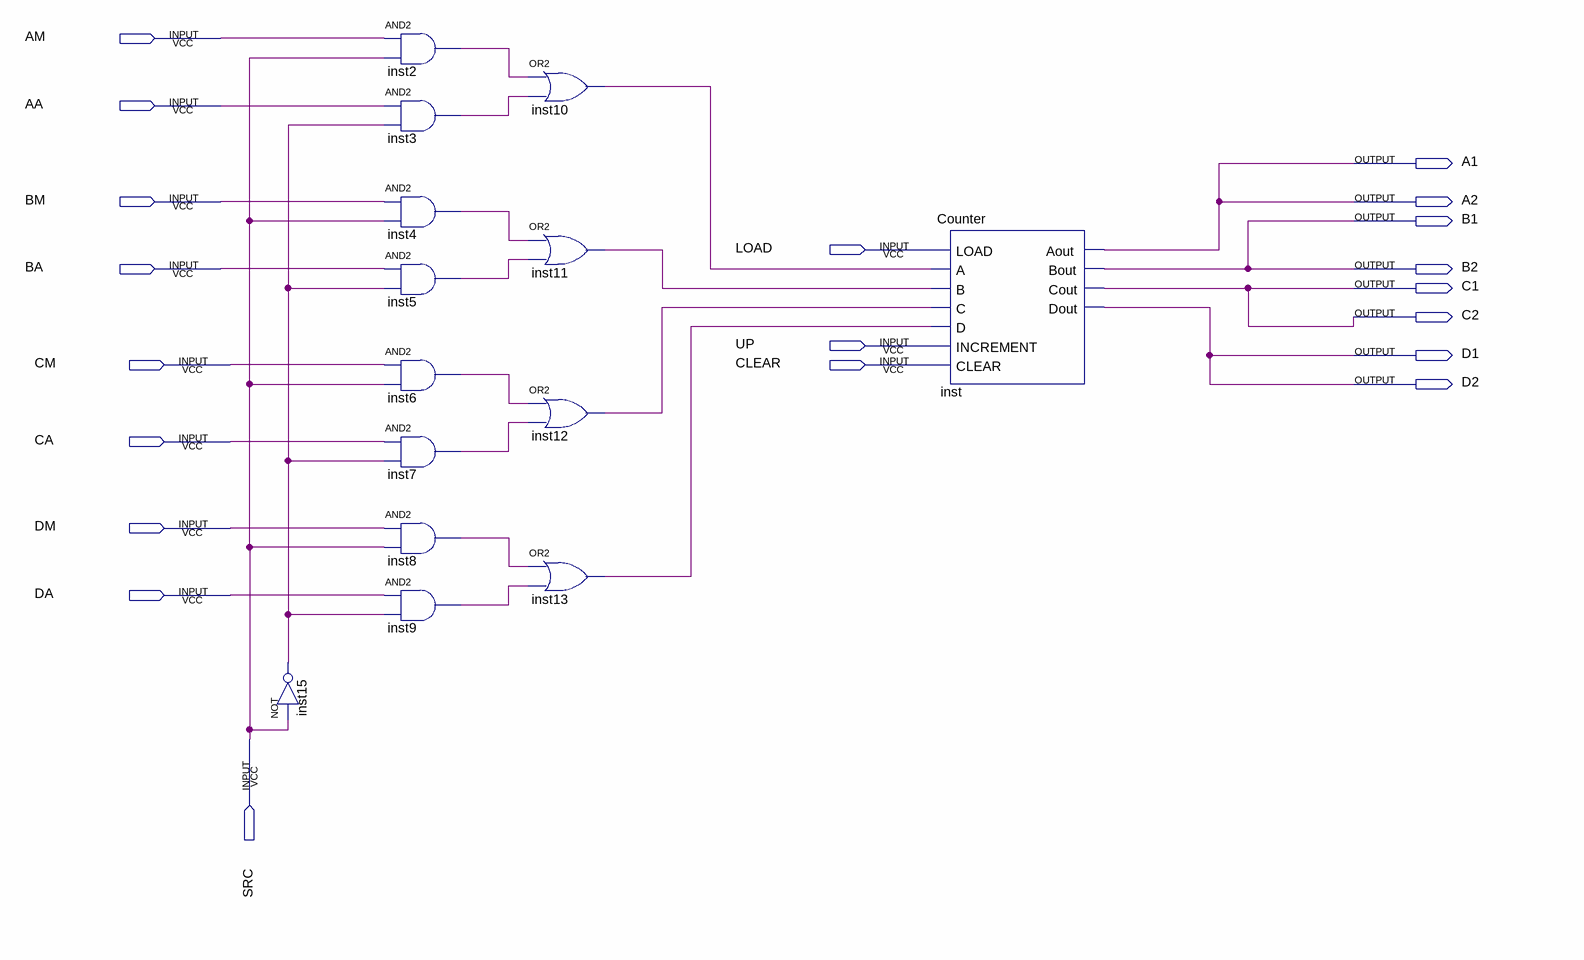
[diagram p0: schematic sheet]
// Quartus schematic Accumulator.bdf as structural Verilog: 14 symbols, 20 pins
module Accumulator (
  input  AM,
  input  AA,
  input  BM,
  input  LOAD,
  input  BA,
  input  UP,
  input  CM,
  input  CLEAR,
  input  CA,
  input  DM,
  input  DA,
  input  SRC,
  output A1,
  output A2,
  output B1,
  output B2,
  output C1,
  output C2,
  output D1,
  output D2
);

  wire inst2_out, inst3_out, inst4_out, inst5_out, inst6_out, inst7_out, inst8_out, inst9_out, inst10_out,
       inst11_out, inst12_out, inst13_out, inst15_out;

  not inst15 (inst15_out, SRC);
  and inst2 (inst2_out, AM, SRC);
  and inst3 (inst3_out, AA, inst15_out);
  and inst4 (inst4_out, BM, SRC);
  and inst5 (inst5_out, BA, inst15_out);
  and inst6 (inst6_out, CM, SRC);
  and inst7 (inst7_out, CA, inst15_out);
  and inst8 (inst8_out, DM, SRC);
  and inst9 (inst9_out, DA, inst15_out);
  or inst10 (inst10_out, inst2_out, inst3_out);
  or inst11 (inst11_out, inst4_out, inst5_out);
  or inst12 (inst12_out, inst6_out, inst7_out);
  or inst13 (inst13_out, inst8_out, inst9_out);
  Counter inst (
    .LOAD(LOAD), .A(inst10_out), .B(inst11_out), .C(inst12_out), .D(inst13_out), .INCREMENT(UP),
    .CLEAR(CLEAR), .Aout(A1), .Bout(B1), .Cout(C1), .Dout(D1));

  assign A2 = A1;
  assign B2 = B1;
  assign C2 = C1;
  assign D2 = D1;
endmodule
